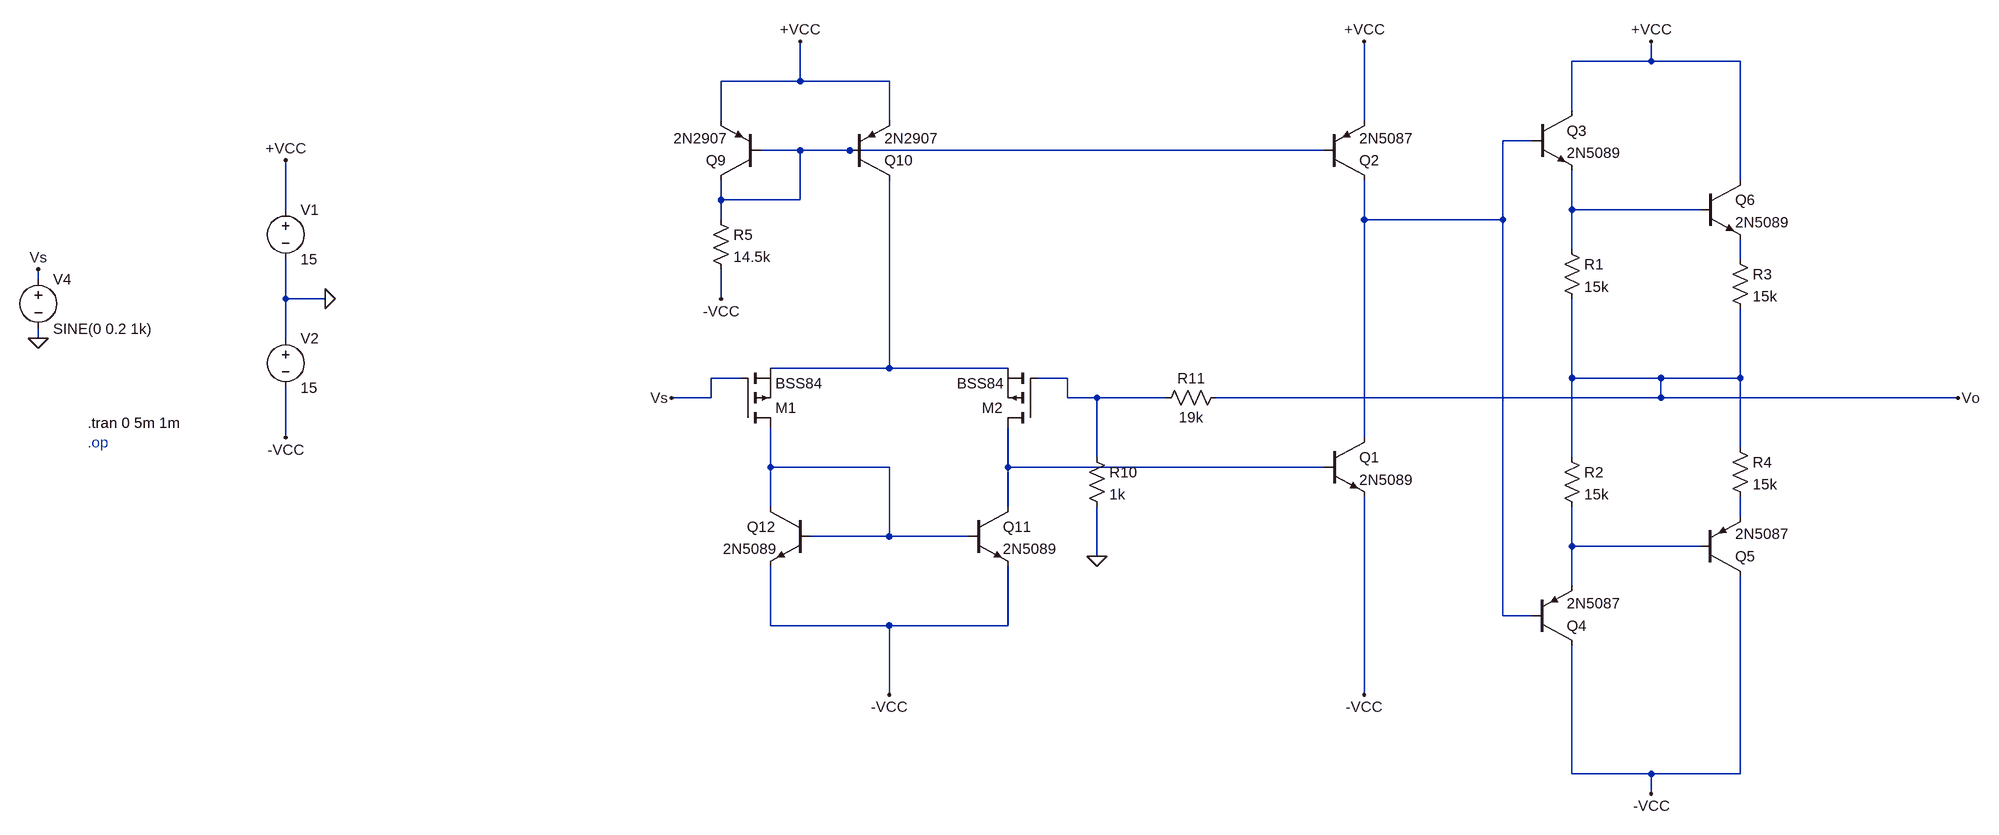
[diagram p0: schematic AmplificadorOperacionalCompleto_v2.asc]
AmplificadorOperacionalCompleto_v2.asc, the LTspice schematic file:
Version 4.1
SHEET 1 4688 1700
WIRE 2240 128 2240 96
WIRE 2240 128 2112 128
WIRE 2384 128 2240 128
WIRE 864 160 864 96
WIRE 864 160 736 160
WIRE 1008 160 864 160
WIRE 2112 208 2112 128
WIRE 736 224 736 160
WIRE 1008 224 1008 160
WIRE 1776 224 1776 96
WIRE 2048 256 2000 256
WIRE 864 272 800 272
WIRE 944 272 864 272
WIRE 1712 272 944 272
WIRE 2384 320 2384 128
WIRE 736 352 736 320
WIRE 864 352 864 272
WIRE 864 352 736 352
WIRE 32 368 32 288
WIRE 2112 368 2112 304
WIRE 2320 368 2112 368
WIRE 736 384 736 352
WIRE 1776 384 1776 320
WIRE 2000 384 2000 256
WIRE 2000 384 1776 384
WIRE 2112 432 2112 368
WIRE 2384 448 2384 416
WIRE -368 480 -368 464
WIRE 32 512 32 448
WIRE 96 512 32 512
WIRE 736 512 736 464
WIRE -368 576 -368 560
WIRE 32 576 32 512
WIRE 1008 624 1008 320
WIRE 1008 624 816 624
WIRE 1200 624 1008 624
WIRE 768 640 720 640
WIRE 1296 640 1248 640
WIRE 2112 640 2112 512
WIRE 2256 640 2112 640
WIRE 2384 640 2384 528
WIRE 2384 640 2256 640
WIRE 720 672 720 640
WIRE 720 672 656 672
WIRE 1296 672 1296 640
WIRE 1344 672 1296 672
WIRE 1456 672 1344 672
WIRE 2256 672 2256 640
WIRE 2256 672 1536 672
WIRE 2736 672 2256 672
WIRE 32 736 32 656
WIRE 1776 736 1776 384
WIRE 2384 752 2384 640
WIRE 1344 768 1344 672
WIRE 2112 768 2112 640
WIRE 816 784 816 720
WIRE 1008 784 816 784
WIRE 1200 784 1200 720
WIRE 1712 784 1200 784
WIRE 816 848 816 784
WIRE 1200 848 1200 784
WIRE 2384 864 2384 832
WIRE 1008 896 1008 784
WIRE 1008 896 880 896
WIRE 1136 896 1008 896
WIRE 2112 912 2112 848
WIRE 2320 912 2112 912
WIRE 1344 928 1344 848
WIRE 2112 976 2112 912
WIRE 2000 1024 2000 384
WIRE 2048 1024 2000 1024
WIRE 816 1040 816 944
WIRE 1008 1040 816 1040
WIRE 1200 1040 1200 944
WIRE 1200 1040 1008 1040
WIRE 1008 1152 1008 1040
WIRE 1776 1152 1776 832
WIRE 2112 1280 2112 1072
WIRE 2240 1280 2112 1280
WIRE 2384 1280 2384 960
WIRE 2384 1280 2240 1280
WIRE 2240 1312 2240 1280
FLAG 32 288 +VCC
FLAG 32 736 -VCC
FLAG -368 464 Vs
FLAG -368 576 0
FLAG 96 512 0
FLAG 736 512 -VCC
FLAG 864 96 +VCC
FLAG 1008 1152 -VCC
FLAG 656 672 Vs
FLAG 1776 1152 -VCC
FLAG 1776 96 +VCC
FLAG 2240 1312 -VCC
FLAG 2240 96 +VCC
FLAG 1344 928 0
FLAG 2736 672 Vo
SYMBOL voltage 32 352 R0
WINDOW 123 0 0 Left 0
WINDOW 39 0 0 Left 0
SYMATTR InstName V1
SYMATTR Value 15
SYMBOL voltage 32 560 R0
WINDOW 123 0 0 Left 0
WINDOW 39 0 0 Left 0
SYMATTR InstName V2
SYMATTR Value 15
SYMBOL voltage -368 464 R0
WINDOW 123 0 0 Left 0
WINDOW 39 0 0 Left 0
SYMATTR InstName V4
SYMATTR Value SINE(0 0.2 1k)
SYMBOL res 720 368 R0
SYMATTR InstName R5
SYMATTR Value 14.5k
SYMBOL pnp 800 320 R180
SYMATTR InstName Q9
SYMATTR Value 2N2907
SYMBOL pnp 944 320 M180
SYMATTR InstName Q10
SYMATTR Value 2N2907
SYMBOL npn 1136 848 R0
SYMATTR InstName Q11
SYMATTR Value 2N5089
SYMBOL npn 880 848 M0
SYMATTR InstName Q12
SYMATTR Value 2N5089
SYMBOL npn 1712 736 R0
SYMATTR InstName Q1
SYMATTR Value 2N5089
SYMBOL pnp 1712 320 M180
SYMATTR InstName Q2
SYMATTR Value 2N5087
SYMBOL pmos 768 720 M180
SYMATTR InstName M1
SYMATTR Value BSS84
SYMBOL pmos 1248 720 R180
SYMATTR InstName M2
SYMATTR Value BSS84
SYMBOL npn 2048 208 R0
SYMATTR InstName Q3
SYMATTR Value 2N5089
SYMBOL res 2096 416 R0
SYMATTR InstName R1
SYMATTR Value 15k
SYMBOL res 2096 752 R0
SYMATTR InstName R2
SYMATTR Value 15k
SYMBOL pnp 2048 1072 M180
SYMATTR InstName Q4
SYMATTR Value 2N5087
SYMBOL pnp 2320 960 M180
SYMATTR InstName Q5
SYMATTR Value 2N5087
SYMBOL npn 2320 320 R0
SYMATTR InstName Q6
SYMATTR Value 2N5089
SYMBOL res 2368 432 R0
SYMATTR InstName R3
SYMATTR Value 15k
SYMBOL res 2368 736 R0
SYMATTR InstName R4
SYMATTR Value 15k
SYMBOL res 1328 752 R0
SYMATTR InstName R10
SYMATTR Value 1k
SYMBOL res 1552 656 R90
WINDOW 0 0 56 VBottom 2
WINDOW 3 32 56 VTop 2
SYMATTR InstName R11
SYMATTR Value 19k
TEXT -288 712 Left 2 !.tran 0 5m 1m
TEXT -288 744 Left 2 ;.op

The netlist it stands for:
* AmplificadorOperacionalCompleto_v2.asc
V1 +VCC 0 15
V2 0 -VCC 15
V4 Vs 0 SINE(0 0.2 1k)
R5 N002 -VCC 14.5k
Q9 N002 N002 +VCC 0 2N2907
Q10 N005 N002 +VCC 0 2N2907
Q11 N008 N007 -VCC 0 2N5089
Q12 N007 N007 -VCC 0 2N5089
Q1 N001 N008 -VCC 0 2N5089
Q2 N001 N002 +VCC 0 2N5087
M1 N007 Vs N005 N005 BSS84
M2 N008 N006 N005 N005 BSS84
Q3 +VCC N001 N003 0 2N5089
R1 N003 Vo 15k
R2 Vo N010 15k
Q4 -VCC N001 N010 0 2N5087
Q5 -VCC N010 N009 0 2N5087
Q6 +VCC N003 N004 0 2N5089
R3 N004 Vo 15k
R4 Vo N009 15k
R10 N006 0 1k
R11 Vo N006 19k
.model NPN NPN
.model PNP PNP
.lib standard.bjt
.model NMOS NMOS
.model PMOS PMOS
.lib standard.mos
.tran 0 5m 1m
* .op
.backanno
.end